# Altium schematic sheet Ethernet Interface.SchDoc
size A
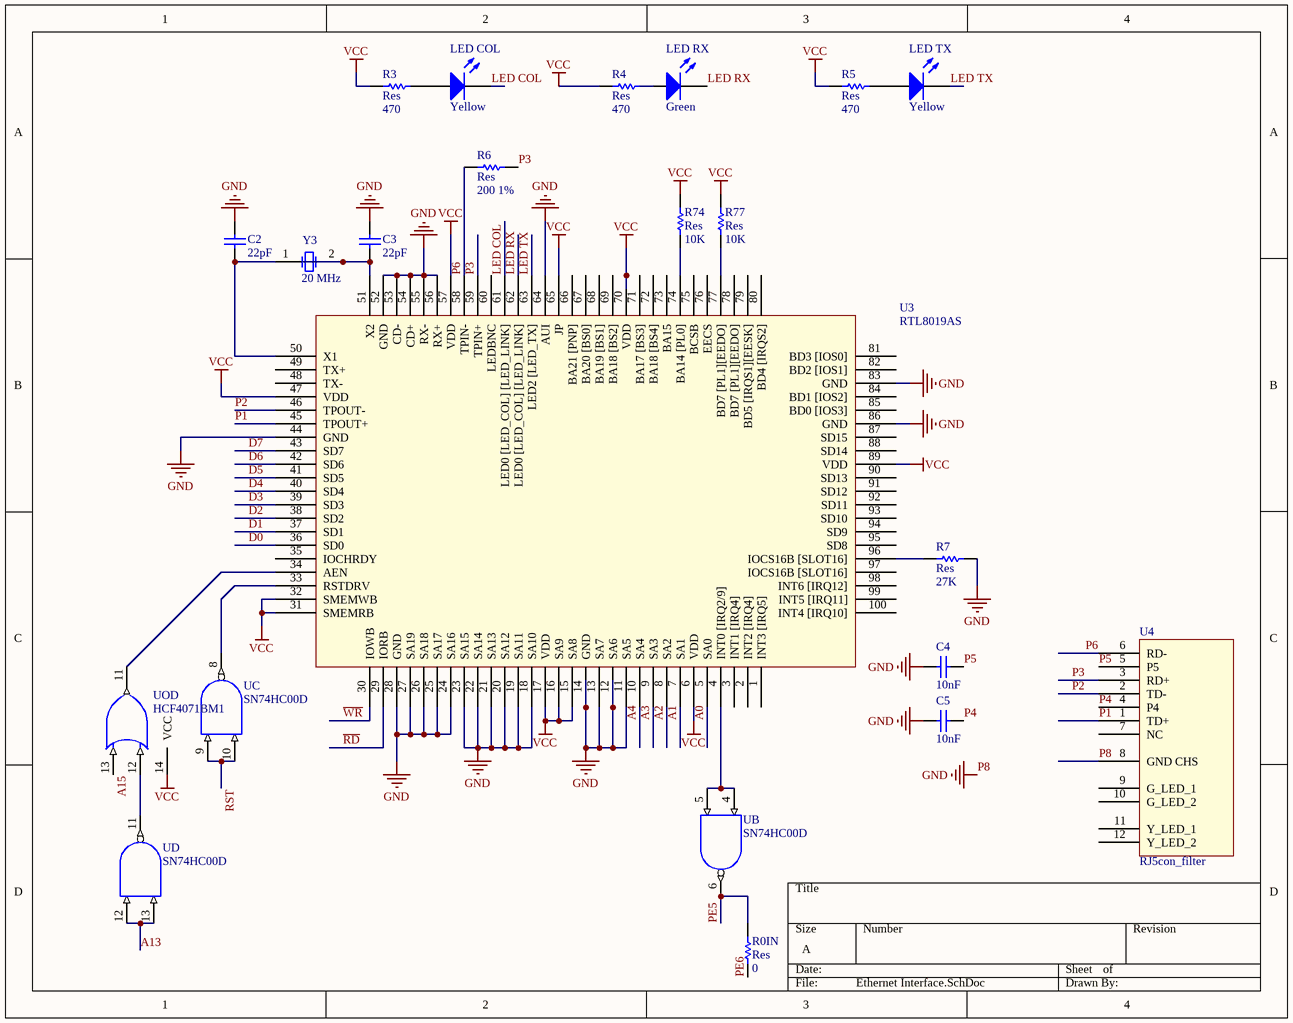
[diagram p0: Ethernet Interface.SchDoc]

## Parts
C2  value 22pF  [1608[0603]]  (hidden comment: Cap_UP)
C3  value 22pF  [1608[0603]]  (hidden comment: Cap_UP)
C4  value 10nF  [1608[0603]]  (hidden comment: Cap_UP)
C5  value 10nF  [1608[0603]]  (hidden comment: Cap_UP)
LED_COL  Yellow  [3518]
LED_RX  Green  [3518]
LED_TX  Yellow  [3518]
R0IN  Res  value 0  [1608[0603]]
R3  Res  value 470  [1608[0603]]
R4  Res  value 470  [1608[0603]]
R5  Res  value 470  [1608[0603]]
R6  Res  value 200 1%  [1608[0603]]
R7  Res  value 27K  [1608[0603]]
R74  Res  value 10K  [1608[0603]]
R77  Res  value 10K  [1608[0603]]
U  SN74HC00D  [D014_N]  (parts B,C,D of 4)
U3  RTL8019AS  [RTL8019AS]
U4  RJ5con_filter  [RJ45con_Filter]
UO  HCF4071BM1  [SO14_N]  (part D of 4)
Y3  20 MHz  [Xtal-smd]

## Nets
P8: C2.2 C3.2 C4.1 C5.1 R7.1 U.7(GND) U3.11(SA5) U3.12(SA6) U3.13(SA7) U3.14(GND) U3.18(SA10) U3.19(SA11) U3.20(SA12) U3.21(SA13) U3.22(SA14) U3.23(SA15) U3.24(SA16) U3.25(SA17) U3.26(SA18) U3.27(SA19) U3.28(GND) U3.44(GND) U3.52(GND) U3.53(CD-) U3.54(CD+) U3.55(RX-) U3.56(RX+) U3.64(AUI) U3.83(GND) U3.86(GND) U4.8(GND_CHS) UO.7(GND)  [also labelled GND]
VCC: R3.2 R4.2 R5.2 R74.1 R77.1 U.14(VCC) U3.6(VDD) U3.15(SA8) U3.16(SA9) U3.17(VDD) U3.31(SMEMRB) U3.32(SMEMWB) U3.47(VDD) U3.57(VDD) U3.65(JP) U3.70(VDD) U3.89(VDD) UO.14(VCC)
A0: U3.5(SA0)
A1: U3.7(SA1)
A2: U3.8(SA2)
A3: U3.9(SA3)
A4: U3.10(SA4)
A13: U.12(A) U.13(B)
A15: UO.13(G)
D0: U3.36(SD0)
D1: U3.37(SD1)
D2: U3.38(SD2)
D3: U3.39(SD3)
D4: U3.40(SD4)
D5: U3.41(SD5)
D6: U3.42(SD6)
D7: U3.43(SD7)
LED COL: LED_COL.2(K) U3.61(LED0_[LED_COL]_[LED_LINK])
LED RX: LED_RX.2(K) U3.62(LED0_[LED_COL]_[LED_LINK])
LED TX: LED_TX.2(K) U3.63(LED2_[LED_TX])
P1: U3.45(TPOUT+) U4.1(TD+)
P2: U3.46(TPOUT-) U4.2(TD-)
P3: R6.2 U3.59(TPIN+) U4.3(RD+)
P4: C5.2 U4.4(P4)
P5: C4.2 U4.5(P5)
P6: R6.1 U3.58(TPIN-) U4.6(RD-)
PE5: R0IN.1 U.6(Y)
PE6: R0IN.2
~{RD}: U3.29(IORB)
RST: U.9(A) U.10(B)
~{WR}: U3.30(IOWB)
NetC2_1: C2.1 U3.50(X1) Y3.1(OSC1)
NetC3_1: C3.1 U3.51(X2) Y3.2(OSC2)
NetLED_COL_1: LED_COL.1(A) R3.1
NetLED_RX_1: LED_RX.1(A) R4.1
NetLED_TX_1: LED_TX.1(A) R5.1
NetR7_2: R7.2 U3.96(IOCS16B_[SLOT16])
NetR74_2: R74.2 U3.74(BA14_[PL0])
NetR77_2: R77.2 U3.77(BD7_[PL1][EEDO])
NetU3_34: U3.34(AEN) UO.11(M)
NetU_4: U.4(A) U.5(B) U3.4(INT0_[IRQ2/9])
NetU_8: U.8(Y) U3.33(RSTDRV)
NetU_11: U.11(Y) UO.12(H)

Not connected (* = marked no-connect by the designer): U3 1(INT3_[IRQ5]) 2(INT2_[IRQ4]) 3(INT1_[IRQ4]) 35(IOCHRDY) 48(TX-) 49(TX+) 60(LEDBNC) 66(BA21_[PNP]) 67(BA20_[BS0]) 68(BA19_[BS1]) 69(BA18_[BS2]) 71(BA17_[BS3]) 72(BA18_[BS4]) 73(BA15) 75(BCSB) 76(EECS) 78(BD7_[PL1][EEDO]) 79(BD5_[IRQS1][EESK]) 80(BD4_[IRQS2]) 81(BD3_[IOS0]) 82(BD2_[IOS1]) 84(BD1_[IOS2]) 85(BD0_[IOS3]) 87(SD15) 88(SD14) 90(SD13) 91(SD12) 92(SD11) 93(SD10) 94(SD9) 95(SD8) 97(IOCS16B_[SLOT16]) 98(INT6_[IRQ12]) 99(INT5_[IRQ11]) 100(INT4_[IRQ10]); U4 7(NC) 9(G_LED_1) 10(G_LED_2) 11(Y_LED_1) 12(Y_LED_2)

## Library data of the parts
C2-C5 = Cap_UP: Capacitor; Published: 8-Jun-2000; LatestRevisionDate: 17-Jul-2002; LatestRevisionNote: Re-released for DXP Platform.; PackageReference: RAD-0.3; Publisher: Altium Limited
LED_COL LED_RX LED_TX = LED3: Typical BLUE SiC LED; Published: 8-Jun-2000; LatestRevisionDate: 17-Dec-2003; LatestRevisionNote: PCB Footprint replaced.; DatasheetVersion: 16-Apr-2002; PackageVersion: 16-Apr-2002; PackageReference: 3.5X2.8X1.9; Publisher: Altium Limited; PackageDescription: SM LED; 2 C-Bend Leads; Body 3.5 x 2.8 x 1.9 mm, inc leads (LxWxH typ)
R0IN R3-R7 R74 R77 = Res: Semiconductor Resistor; Published: 8-Jun-2000; LatestRevisionDate: 17-Jul-2002; LatestRevisionNote: Re-released for DXP Platform.; PackageReference: AXIAL-0.5; Publisher: Altium Limited
U = SN74HC00D: Quadruple 2-Input Positive-NAND Gate; Published: 8-Jun-2000; LatestRevisionDate: 13-Apr-2006; LatestRevisionNote: IPC-7351 Footprint Added.; DatasheetVersion: May-1997; PackageVersion: Jan-1998; PackageReference: D014; Publisher: Altium Limited; PackageDescription: 14-Pin Small Outline Integrated Circuit 1.27 mm Pitch; Code_IPC: SOIC127P600-14; ComponentLink1Description: Manufacturer Link; ComponentLink1URL: http://www.ti.com/; ComponentLink2Description: Datasheet; ComponentLink2URL: http://www-s.ti.com/sc/ds/sn74hc00.pdf
U3 = RTL8019_as
U4 = HR911105A
UO = HCF4071BM1: Quad 2-Input OR Gate; Published: 8-Jun-2000; LatestRevisionDate: 13-Apr-2006; LatestRevisionNote: IPC-7351 Footprint Added.; DatasheetVersion: Jun-1989; PackageVersion: Sep-1998; PackageReference: SO14; Publisher: Altium Limited; PackageDescription: 14-Pin Small Outline Integrated Circuit 1.27 mm Pitch; Code_IPC: SOIC127P600-14; ComponentLink1Description: Manufacturer Link; ComponentLink1URL: http://www.st.com/; ComponentLink2Description: Datasheet; ComponentLink2URL: http://www.st.com/stonline/products/literature/ds/2062/hcf4071.pdf
Y3 = XTAL: Crystal Oscillator; Published: 8-Jun-2000; LatestRevisionDate: 17-Jul-2002; LatestRevisionNote: Re-released for DXP Platform.; PackageReference: R38; Publisher: Altium Limited